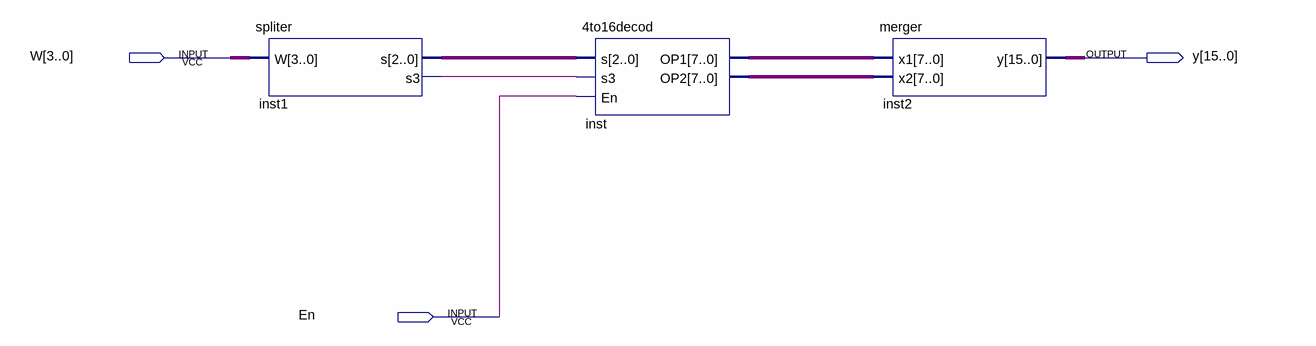
[diagram p0: schematic sheet]
// Quartus schematic modifiedDecod.bdf as structural Verilog: 3 symbols, 3 pins
module modifiedDecod (
  input  [3:0] W,
  input  En,
  output [15:0] y
);

  wire inst1_s3;
  wire [2:0] inst1_s;
  wire [7:0] inst_op1, inst_op2;

  spliter inst1 (.W(W), .s(inst1_s), .s3(inst1_s3));
  \4to16decod  inst (.s(inst1_s), .s3(inst1_s3), .En(En), .OP1(inst_op1), .OP2(inst_op2));
  merger inst2 (.x1(inst_op1), .x2(inst_op2), .y(y));
endmodule
